# Altium schematic sheet SFPplusConn.SchDoc
size A4
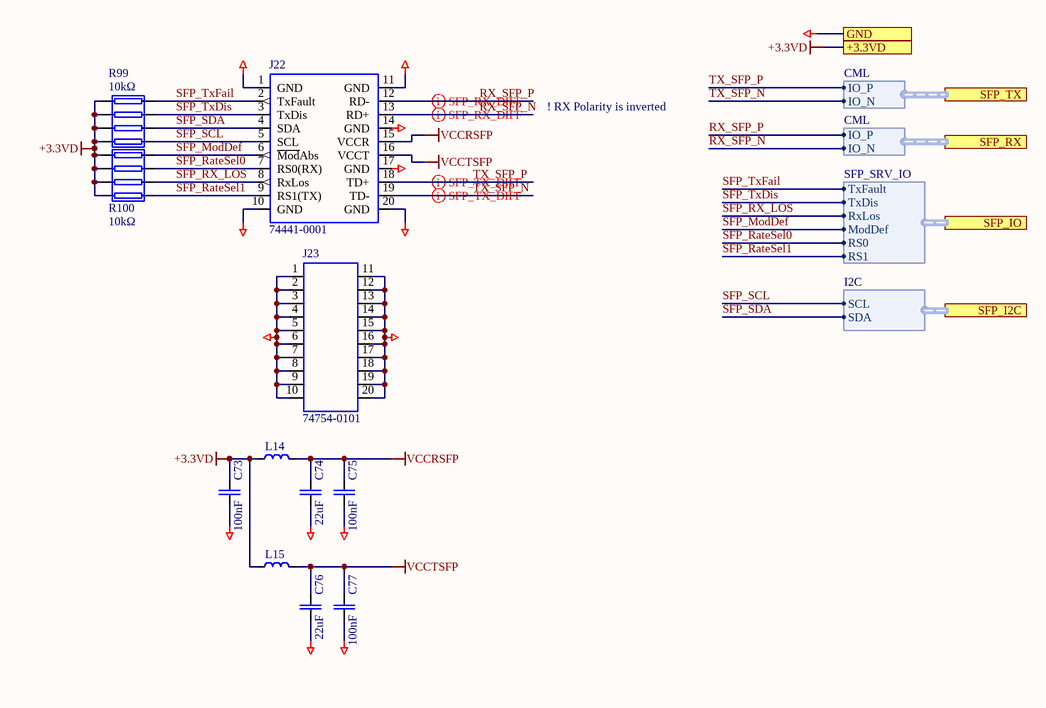
[diagram p0: SFPplusConn.SchDoc]

## Parts
C73  100nF  [CAPC1608N]
C74  22uF  [CAPC2012N]
C75  100nF  [CAPC1608N]
C76  22uF  [CAPC2012N]
C77  100nF  [CAPC1608N]
J22  74441-0001  [MOLEX_74441-0001]
J23  74754-0101  [MOLEX_74737-0111]
L14  BLM21PG221SN1  [INDC2012N]  (value not drawn)
L15  BLM21PG221SN1  [INDC2012N]  (value not drawn)
R99  value 10kΩ  [CAY16-J4]  (hidden comment: CAY16-1002F4LF)
R100  value 10kΩ  [CAY16-J4]  (hidden comment: CAY16-1002F4LF)

## Ports
+3.3VD, GND, SFP_I2C (harness I2C), SFP_IO (harness SFP_SRV_IO), SFP_RX (harness CML), SFP_TX (harness CML)

## Harnesses
CML: IO_N, IO_P
SFP_SRV_IO: TxDis, TxFault, RS0, RS1, ModDef, RxLos
I2C: SDA, SCL

## Nets
+3.3VD: C73.2 L14.1 L15.1 R99.1 R99.2 R99.3 R99.4 R100.1 R100.2 R100.3 R100.4 ; port +3.3VD
GND: C73.1 C74.1 C75.1 C76.1 C77.1 J22.1(GND) J22.10(GND) J22.11(GND) J22.14(GND) J22.17(GND) J22.20(GND) J23.1 J23.2 J23.3 J23.4 J23.5 J23.6 J23.7 J23.8 J23.9 J23.10 J23.11 J23.12 J23.13 J23.14 J23.15 J23.16 J23.17 J23.18 J23.19 J23.20 ; port GND
VCCRSFP: C74.2 C75.2 J22.15(VCCR) L14.2
VCCTSFP: C76.2 C77.2 J22.16(VCCT) L15.2
RX_SFP_N: J22.13(RD+) ; port SFP_RX.IO_N
RX_SFP_P: J22.12(RD-) ; port SFP_RX.IO_P
SFP_ModDef: J22.6(~{Mod}Abs) R100.8 ; port SFP_IO.ModDef
SFP_RateSel0: J22.7(RS0(RX)) R100.7 ; port SFP_IO.RS0
SFP_RateSel1: J22.9(RS1(TX)) R100.5 ; port SFP_IO.RS1
SFP_RX_LOS: J22.8(RxLos) R100.6 ; port SFP_IO.RxLos
SFP_SCL: J22.5(SCL) R99.5 ; port SFP_I2C.SCL
SFP_SDA: J22.4(SDA) R99.6 ; port SFP_I2C.SDA
SFP_TxDis: J22.3(TxDis) R99.7 ; port SFP_IO.TxDis
SFP_TxFail: J22.2(TxFault) R99.8 ; port SFP_IO.TxFault
TX_SFP_N: J22.19(TD-) ; port SFP_TX.IO_N
TX_SFP_P: J22.18(TD+) ; port SFP_TX.IO_P

## Layout directives
differential pair; rule Differential Pairs Routing [Pref Gap = 0.175mm    Min Gap  = 0.075mm    Max Gap  = 0.5mmPref Width = 0.25mm    Min Width  = 0.075mm    Max Width  = 0.5mm]: RX_SFP_N, RX_SFP_P, TX_SFP_N, TX_SFP_P

## Notes on the sheet
- ! RX Polarity is inverted

## Library data of the parts
C73 C75 C77 = CAPC: Generic ceramic SMD capacitor; Pkg: 0603; Maintainer: Evgeniy Kotov; SMD Solders: 2; THD Solders: 0; PartField: 100nF; Last Change Data: 06.03.2017; Release Date: 06.03.2017; Value: 100nF
C74 C76 = CAPC: Generic ceramic SMD capacitor; Pkg: 0805; Maintainer: Evgeniy Kotov; SMD Solders: 2; THD Solders: 0; PartField: 22uF; Last Change Data: 06.03.2017; Release Date: 06.03.2017; Value: 22uF
J22 = MOLEX-74441-0001: CONN SFP+ RCPT 20POS SLD R/A SMD; Pkg: SMD SFP conn; SMD Solders: 20; THD Solders: 0; RoHSCompliant: True; ComponentLink3URL: http://www.molex.com/pdm_docs/sd/747540101_sd.pdf; Width: 49 mm; Height: 10.85 mm; Mounting Technology: Through Hole; ComponentLink2Description: Datasheet; ComponentLink3Description: Package Specification; DatasheetVersion: Rev. Jul-15; Package Quantity: 1152; PackageDescription: CONN SFP+ RCPT 20POS SLD R/A SMD; Radiation Hardening: No; PackageVersion: Rev. J, 02/2015; ComponentLink1Description: Manufacturer URL; PartNumber: 74441-0001; ComponentLink1URL: http://www.molex.com/; Packaging: Tray; Length: 15.9 mm; ComponentLink2URL: http://www.molex.com/webdocs/datasheets/pdf/en-us/0747540101_IO_CONNECTORS.pdf; Value: 74441-0001; PartField: 74441-0001
J23 = MOLX-74754-0101: SFP+ Cage, Single Port, Height 10.85 mm, Tail Height 3.05 mm, -40 to 85 degC, RoHS, Tray; Pkg: SFP cage; SMD Solders: 0; THD Solders: 20; RoHSCompliant: True; ComponentLink3URL: http://www.molex.com/pdm_docs/sd/747540101_sd.pdf; Width: 49 mm; Height: 10.85 mm; Mounting Technology: Through Hole; ComponentLink2Description: Datasheet; ComponentLink3Description: Package Specification; DatasheetVersion: Rev. Jul-15; Package Quantity: 1152; PackageDescription: SFP+ Cage, Single Port, Height 10.85 mm, Tail Height 3.05 mm; Radiation Hardening: No; PackageVersion: Rev. J, 02/2015; ComponentLink1Description: Manufacturer URL; PartNumber: 74754-0101; ComponentLink1URL: http://www.molex.com/; Packaging: Tray; Length: 15.9 mm; ComponentLink2URL: http://www.molex.com/webdocs/datasheets/pdf/en-us/0747540101_IO_CONNECTORS.pdf; Value: 74754-0101; PartField: 74754-0101
L14 L15 = BLM21PG221SN1: Ferrite Beads, 0805, 220 Ohm, 2A; Pkg: 0805; Vendor: Murata; Maintainer: Evgeniy Kotov; SMD Solders: 2; THD Solders: 0; DC Current: 200mA; Tolerance: 25%; DC Resistance: 50mΩ; PartField: BLM21PG221SN1; Release Date: 30.03.2017; Last Change Data: 30.03.2017; Temperature Range: -55°C to +125°C; Value: BLM21PG221SN1
R99 R100 = RESPACK4: Maintainer: Anton Pavlenko; Pkg: SMD 8pin; SMD Solders: 8; THD Solders: 0; PartField: CAY16-1002F4LF; Last Change Data: 16.05.2019; Release Date: 16.05.2019